# EAGLE design CCM_0008 (EAGLE 9.3.1)
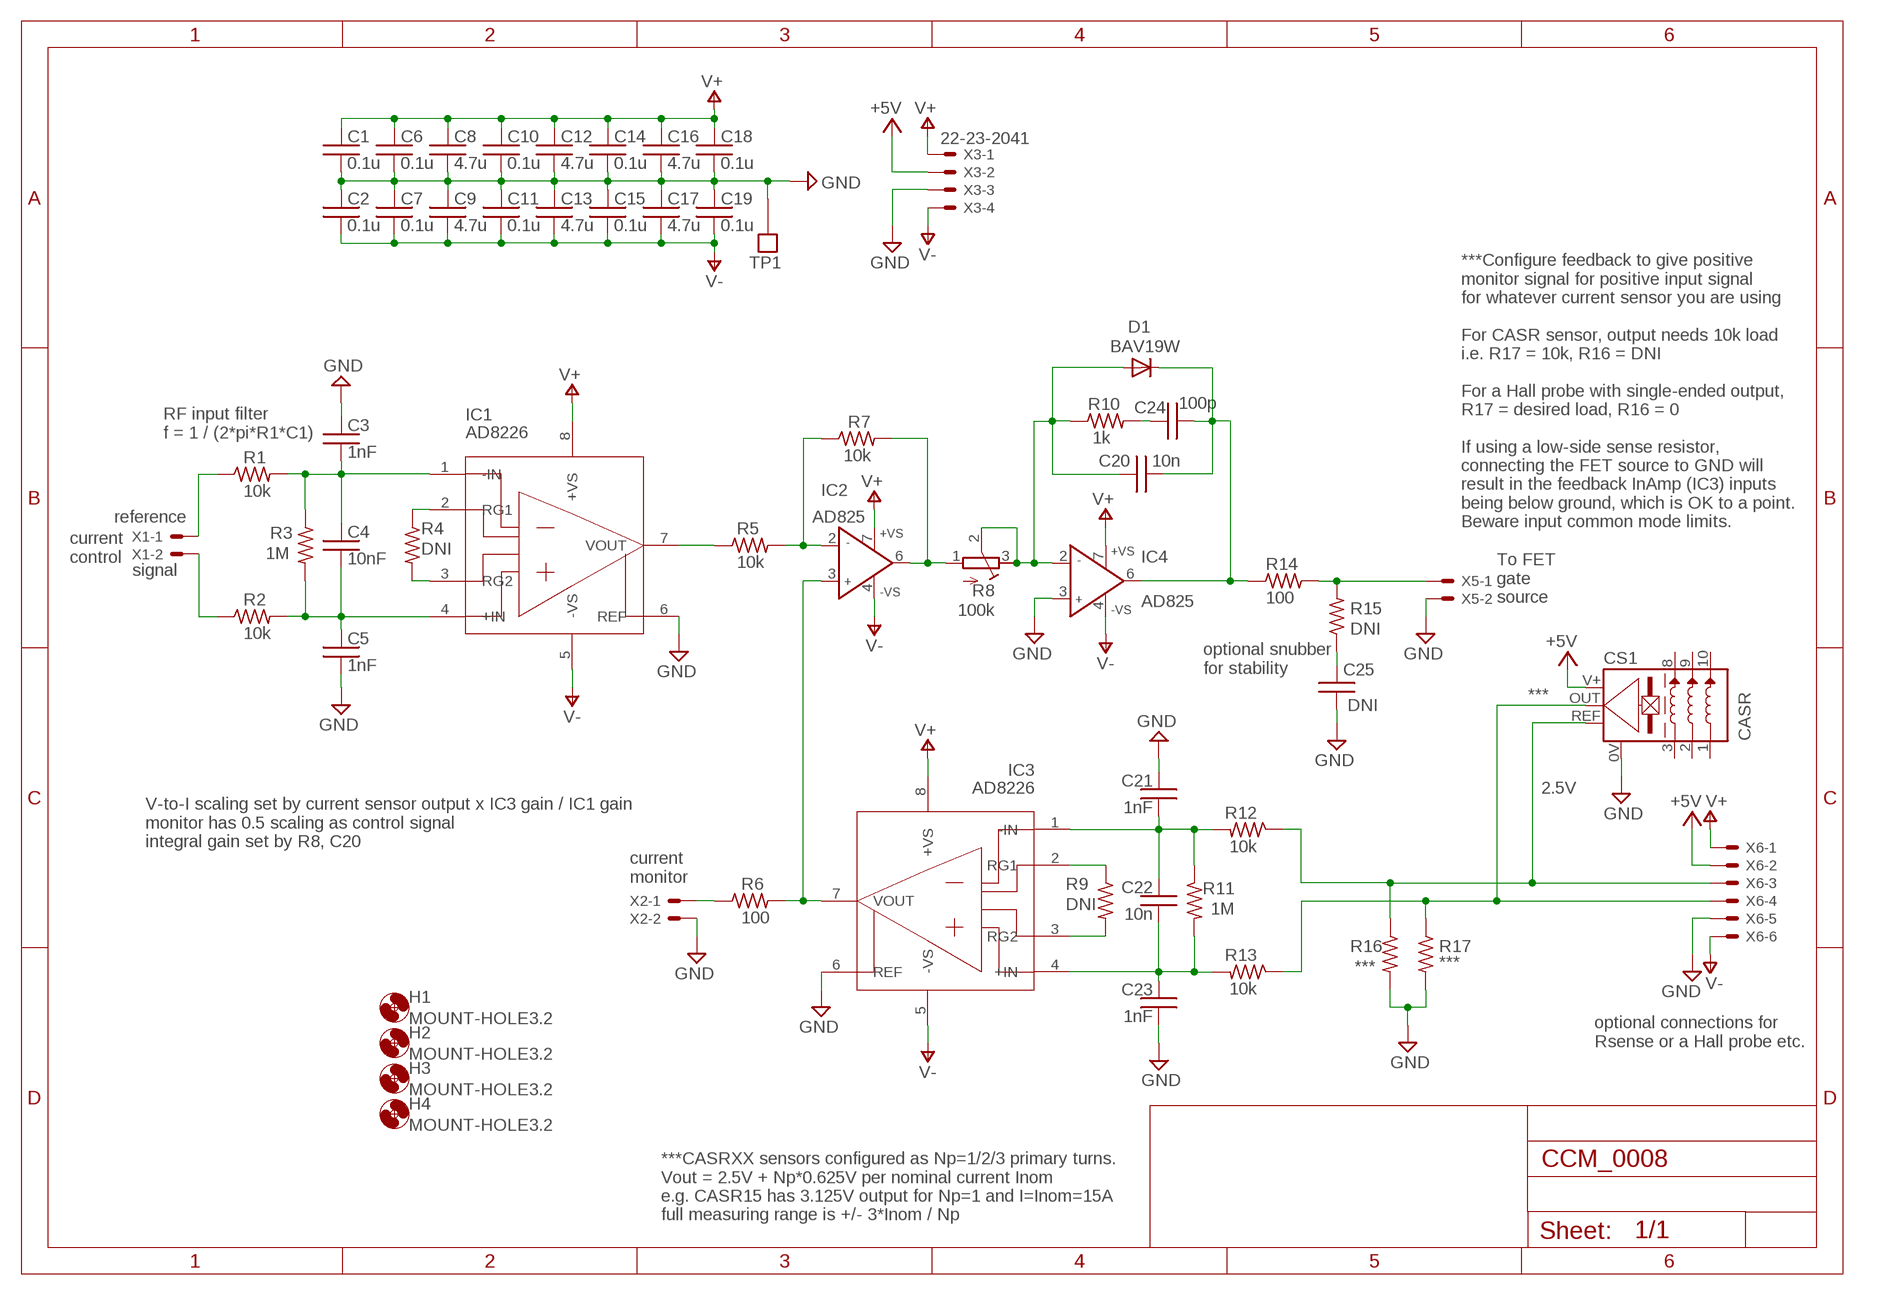
[diagram p0: schematic, sheet 1]

## Parts
C1  0.1u  C0603  [0603]
C2  0.1u  C0603  [0603]
C3  1nF  C0603  [0603]
C4  10nF  C0603  [0603]
C5  1nF  C0603  [0603]
C6  0.1u  C0603  [0603]
C7  0.1u  C0603  [0603]
C8  4.7u  C0603  [0603]
C9  4.7u  C0603  [0603]
C10  0.1u  C0603  [0603]
C11  0.1u  C0603  [0603]
C12  4.7u  C0603  [0603]
C13  4.7u  C0603  [0603]
C14  0.1u  C0603  [0603]
C15  0.1u  C0603  [0603]
C16  4.7u  C0603  [0603]
C17  4.7u  C0603  [0603]
C18  0.1u  C0603  [0603]
C19  0.1u  C0603  [0603]
C20  10n  C0603  [0603]
C21  1nF  C0603  [0603]
C22  10n  C0603  [0603]
C23  1nF  C0603  [0603]
C24  100p  C0603  [0603]
C25  DNI  C0603  [0603]
CS1  CASR  [CASR]
D1  BAV19W  DIODE-SOD123  [SOD123]
H1  MOUNT-HOLE3.2  [3,2]
H2  MOUNT-HOLE3.2  [3,2]
H3  MOUNT-HOLE3.2  [3,2]
H4  MOUNT-HOLE3.2  [3,2]
IC1  AD8226  [SO08]
IC2  AD825  AD825_BR  [SO8]
IC3  AD8226  [SO08]
IC4  AD825  AD825_BR  [SO8]
R1  10k  R0603  [0603]
R2  10k  R0603  [0603]
R3  1M  R0603  [0603]
R4  DNI  R0603  [0603]
R5  10k  R0603  [0603]
R6  100  R0603  [0603]
R7  10k  R0603  [0603]
R8  100k  R-TRIMM3296W  [RTRIM3296W]
R9  DNI  R0603  [0603]
R10  1k  R0603  [0603]
R11  1M  R0603  [0603]
R12  10k  R0603  [0603]
R13  10k  R0603  [0603]
R14  100  R0603  [0603]
R15  DNI  R0603  [0603]
R16  ***  R0603  [0603]
R17  ***  R0603  [0603]
TP1  TESTPOINT  [TESTPOINT]
X1  22-23-2021  [22-23-2021]
X2  22-23-2021  [22-23-2021]
X3  22-23-2041  [22-23-2041]
X5  22-23-2021  [22-23-2021]
X6  22-23-2061  [22-23-2061]

## Nets
+5V: CS1.V+ X3.2 X6.2
GND: C1.2 C2.1 C3.1 C5.2 C6.2 C7.1 C8.2 C9.1 C10.2 C11.1 C12.2 C13.1 C14.2 C15.1 C16.2 C17.1 C18.2 C19.1 C21.1 C23.2 C25.2 CS1.0V IC1.6(REF) IC3.6(REF) IC4.3(IN+) R16.2 R17.2 TP1.P$1 X2.2 X3.3 X5.2 X6.5
N$1: R2.1 X1.2
N$2: R1.1 X1.1
N$3: C20.1 C24.1 D1.C IC4.6(OUT) R14.1
N$4: IC1.2(RG1) R4.1
N$5: C3.2 C4.1 IC1.1(-IN) R1.2 R3.1
N$6: C4.2 C5.1 IC1.4(+IN) R2.2 R3.2
N$7: R6.1 X2.1
N$8: IC1.3(RG2) R4.2
N$12: IC2.3(IN+) IC3.7(VOUT) R6.2
N$13: IC1.7(VOUT) R5.1
N$14: IC2.2(IN-) R5.2 R7.1
N$16: IC2.6(OUT) R7.2 R8.1(A)
N$21: CS1.OUT(VOUT) R13.1 R17.1 X6.4
N$23: IC3.2(RG1) R9.1
N$24: IC3.3(RG2) R9.2
N$25: C21.2 C22.1 IC3.1(-IN) R11.1 R12.2
N$26: C22.2 C23.1 IC3.4(+IN) R11.2 R13.2
N$27: CS1.REF(VREF) R12.1 R16.1 X6.3
N$28: C25.1 R15.1
N$30: C24.2 R10.2
N$33: C20.2 D1.A IC4.2(IN-) R8.2(S) R8.3(E) R10.1
N$34: R14.2 R15.2 X5.1
V+: C1.1 C6.1 C8.1 C10.1 C12.1 C14.1 C16.1 C18.1 IC1.8(+VS) IC2.7(+VS) IC3.8(+VS) IC4.7(+VS) X3.1 X6.1
V-: C2.2 C7.2 C9.2 C11.2 C13.2 C15.2 C17.2 C19.2 IC1.5(-VS) IC2.4(-VS) IC3.5(-VS) IC4.4(-VS) X3.4 X6.6
Unconnected: CS1.1(IN1) CS1.2(IN2) CS1.3(IN3) CS1.8(OUT8) CS1.9(OUT9) CS1.10(OUT10)

## Notes on the sheet
- RF input filter 
  f = 1 / (2*pi*R1*C1)
- reference
- ***Configure feedback to give positive
  monitor signal for positive input signal
  for whatever current sensor you are using
  
  For CASR sensor, output needs 10k load
  i.e. R17 = 10k, R16 = DNI
  
  For a Hall probe with single-ended output,
  R17 = desired load, R16 = 0
  
  If using a low-side sense resistor,
  connecting the FET source to GND will
  result in the feedback InAmp (IC3) inputs 
  being below ground, which is OK to a point.
  Beware input common mode limits.
- current
  control
- signal
- To FET
  gate
  source
- optional snubber
  for stability
- ***
- 2.5V
- V-to-I scaling set by current sensor output x IC3 gain / IC1 gain
  monitor has 0.5 scaling as control signal
  integral gain set by R8, C20
- current
  monitor
- optional connections for 
  Rsense or a Hall probe etc.
- ***CASRXX sensors configured as Np=1/2/3 primary turns.
  Vout = 2.5V + Np*0.625V per nominal current Inom
  e.g. CASR15 has 3.125V output for Np=1 and I=Inom=15A
  full measuring range is +/- 3*Inom / Np

## Library data of the parts
C1-C25 = acrooptics:C: Capacitor
CS1 = custom_parts:CASR: LEM CASR current sensor www.lem.com
D1 = AquariumLibrary:DIODE-: DIODE
H1-H4 = holes:MOUNT-HOLE: MOUNTING HOLE with drill center marker
IC1 IC3 = noah:AD8226
IC2 IC4 = noah:AD825_B: Low Cost, General-Purpose High Speed JFET Amplifier Source: http://www.analog.com/static/imported-files/data_sheets/AD825.pdf; MF: ALTERA CORPORATION; MPN: AD825ARZ; OC_FARNELL: 9603735; OC_NEWARK: 59K6528
R1-R7 R9-R17 = acrooptics:R: 0603 resistor
R8 = rcl:R-TRIMM: Trimm resistor; SPICEMODEL: X; SPICEPREFIXL: POT
TP1 = Fitch:TESTPOINT
X1 X2 X5 = con-molex:22-23-2021: .100" (2.54mm) Center Header - 2 Pin; MF: MOLEX; MPN: 22-23-2021; OC_FARNELL: 1462926; OC_NEWARK: 25C3832
X3 = con-molex:22-23-2041: .100" (2.54mm) Center Header - 4 Pin; MF: MOLEX; MPN: 22-23-2041; OC_FARNELL: 1462920; OC_NEWARK: 38C0355
X6 = con-molex:22-23-2061: .100" (2.54mm) Center Header - 6 Pin; MF: MOLEX; MPN: 22-23-2061; OC_FARNELL: 1462922; OC_NEWARK: 27C1933

## Net classes
1 standard: width 0.61 mm, clearance 0.254 mm

## Board
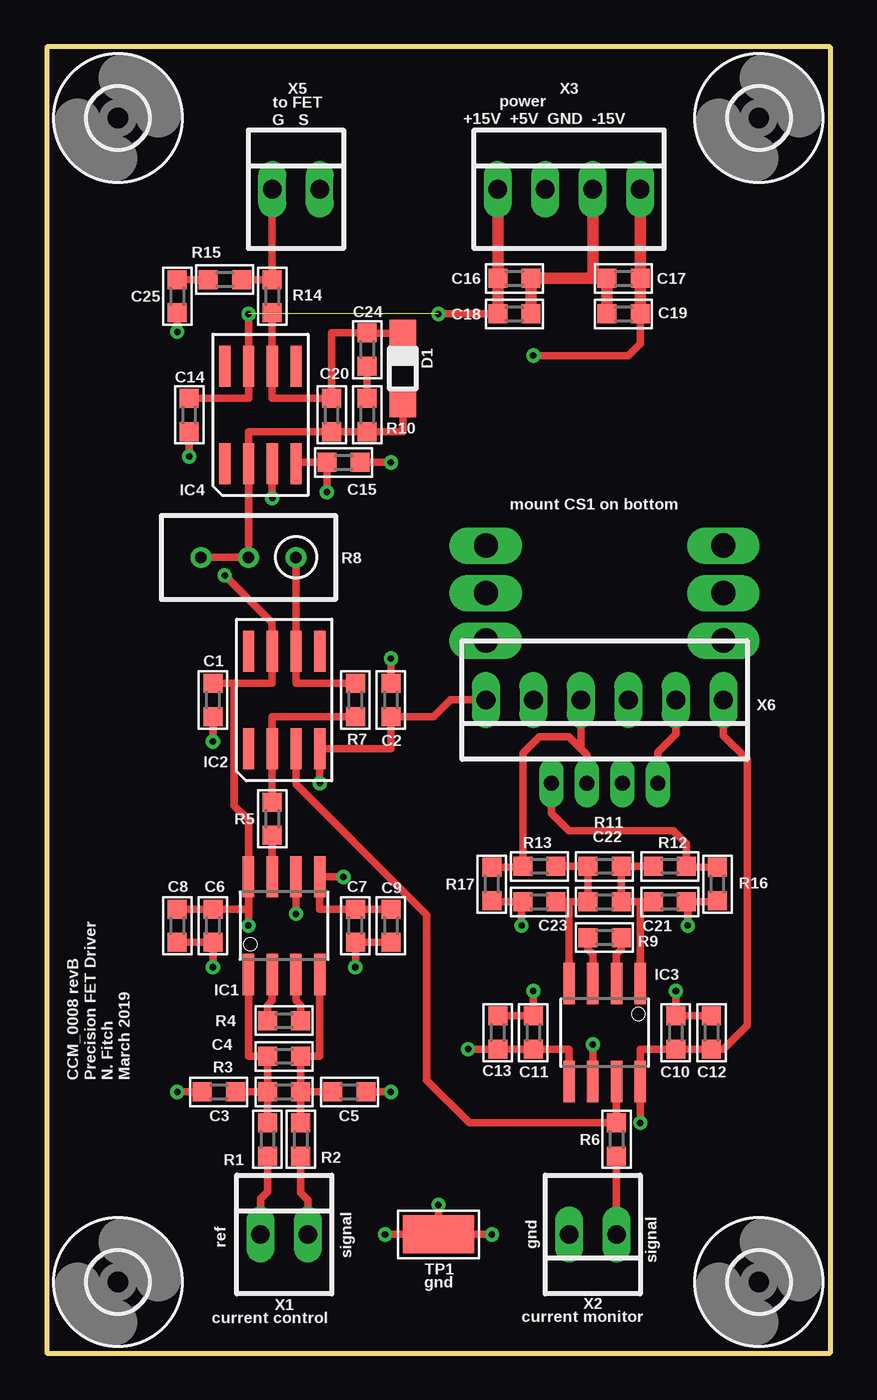
[diagram p1: board, top side]
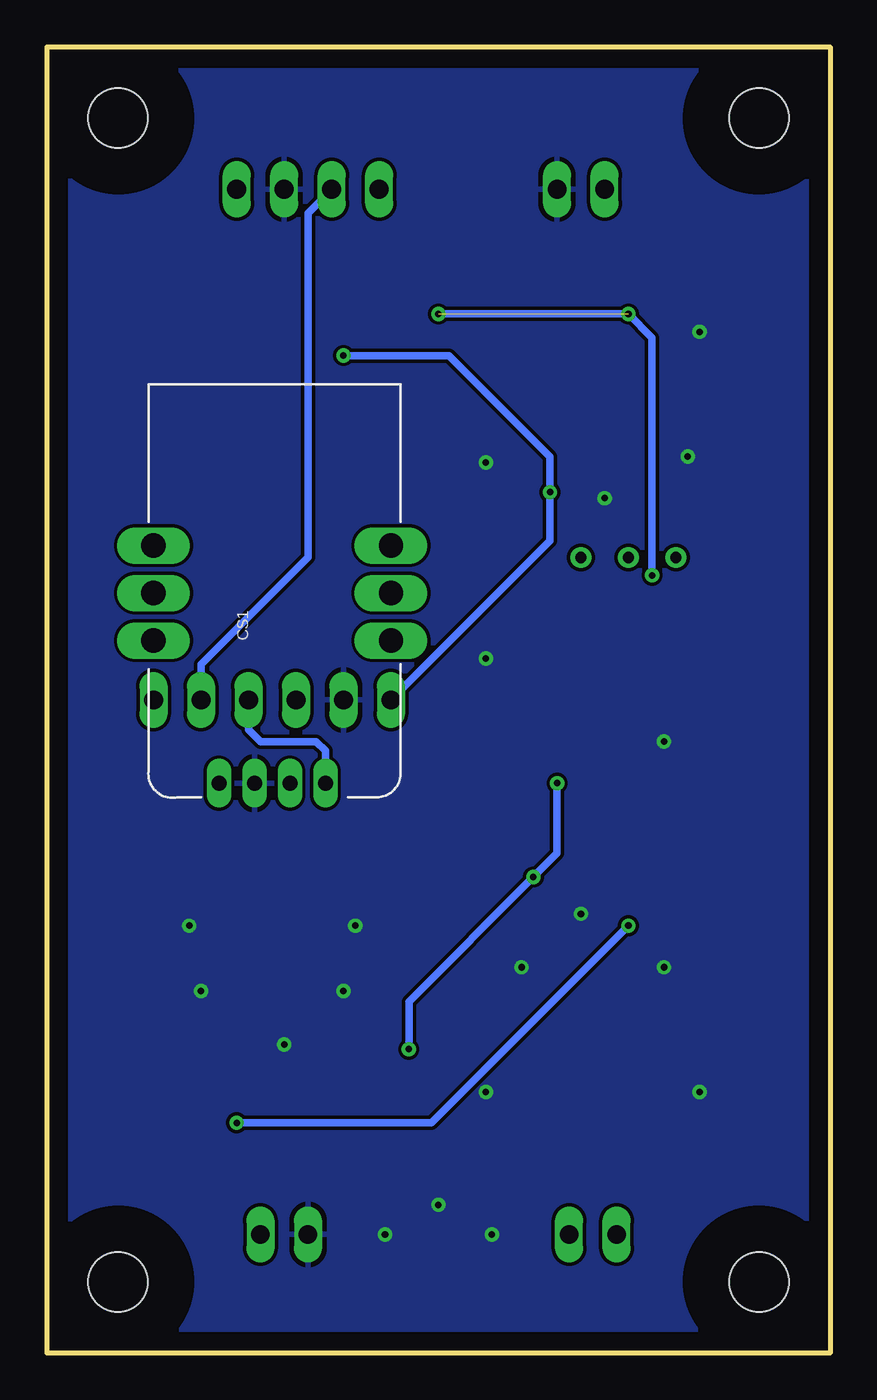
[diagram p2: board, bottom side, seen from below]

Size 41.91 x 69.85 mm. Coordinates in mm from the lower left corner, seen from the top.
Outline: 0,0 41.91,0 41.91,69.85 0,69.85 0,0
Copper layers (1*16): Top 0.035mm / dielectric 1.5mm / Bottom 0.035mm
Design rules "default *": minimum track width 10mil, minimum drill 10mil, track to track 7mil, track to pad 7mil, pad to pad 7mil, via to via 7mil, smd to smd 7mil, copper to edge 10mil, drill to drill 8mil, minimum pad ring 10mil, minimum via ring 8mil, stop-mask expansion 4mil, vias tented up to drill 0mil, thermal gap 10mil

### Footprints (pad centres in the part's own frame; a part is rotated, then mirrored left to right if it is on the bottom)
0603 = smd 1.016 x 1.016: 1 -0.889,0; 2 0.889,0
CASR = drill 0.8 long: 0V -10.16,0.953; OUT -10.16,-0.953; REF -10.16,-2.845; V+ -10.16,2.845 | drill 1.3 long: 1 -2.54,6.35; 2 0,6.35; 3 2.54,6.35; 8 2.54,-6.35; 9 0,-6.35; 10 -2.54,-6.35
SOD123 = smd 1.4 x 1.4: A 1.9,0; C -1.9,0
3,2 = hole 3.2: 0,0
SO08 = smd 0.61 x 2.21: 1 -1.905,-2.616; 2 -0.635,-2.616; 3 0.635,-2.616; 4 1.905,-2.616; 5 1.905,2.616; 6 0.635,2.616; 7 -0.635,2.616; 8 -1.905,2.616
SO8 = smd 0.6 x 2.2: 1 -1.905,-2.6; 2 -0.635,-2.6; 3 0.635,-2.6; 4 1.905,-2.6; 5 1.905,2.6; 6 0.635,2.6; 7 -0.635,2.6; 8 -1.905,2.6
RTRIM3296W = drill 0.61: 1 0,-2.54; 2 0,0; 3 0,2.54
TESTPOINT = smd 3.81 x 2.032: P$1 0,0
22-23-2021 = drill 1 long: 1 -1.27,0; 2 1.27,0
22-23-2041 = drill 1 long: 1 -3.81,0; 2 -1.27,0; 3 1.27,0; 4 3.81,0
22-23-2061 = drill 1 long: 1 -6.35,0; 2 -3.81,0; 3 -1.27,0; 4 1.27,0; 5 3.81,0; 6 6.35,0

### Placement (x,y rotation side)
C1  8.89,34.92 270 top
C2  18.41,34.92 270 top
C3  9.21,13.97 0 top
C4  12.7,15.88 0 top
C5  16.19,13.97 0 top
C6  8.89,22.86 270 top
C7  16.51,22.86 90 top
C8  6.99,22.86 270 top
C9  18.41,22.86 90 top
C10  33.66,17.14 90 top
C11  26.04,17.14 270 top
C12  35.56,17.14 90 top
C13  24.13,17.14 270 top
C14  7.62,50.16 270 top
C15  15.88,47.62 180 top
C16  25.02,57.47 0 top
C17  30.86,57.47 0 top
C18  25.02,55.56 0 top
C19  30.86,55.56 0 top
C20  15.24,50.16 270 top
C21  33.34,24.13 180 top
C22  29.84,24.13 180 top
C23  26.35,24.13 180 top
C24  17.14,53.66 270 top
C25  6.99,56.52 270 top
CS1  29.84,40.64 90 bottom
D1  19.05,52.64 270 top
H1  3.81,3.81 0 top
H2  3.81,66.04 0 top
H3  38.1,3.81 0 top
H4  38.1,66.04 0 top
IC1  12.7,22.86 0 top
IC2  12.7,34.92 0 top
IC3  29.84,17.14 180 top
IC4  11.43,50.16 0 top
R1  11.81,11.43 90 top
R2  13.59,11.43 90 top
R3  12.7,13.97 0 top
R4  12.7,17.78 0 top
R5  12.06,28.57 90 top
R6  30.48,11.43 90 top
R7  16.51,34.92 90 top
R8  10.79,42.55 90 top
R9  29.84,22.23 180 top
R10  17.14,50.16 90 top
R11  29.84,26.04 180 top
R12  33.34,26.04 180 top
R13  26.35,26.04 0 top
R14  12.06,56.52 90 top
R15  9.53,57.4 0 top
R16  35.88,25.08 270 top
R17  23.81,25.08 270 top
TP1  20.95,6.35 0 top
X1  12.7,6.35 0 top
X2  29.21,6.35 180 top
X3  27.94,62.23 0 top
X5  13.34,62.23 0 top
X6  29.84,34.92 180 top

### Tracks (layer width: path | path; a pad name or v marks a point on that pad's centre or on a via)
+5V
  Top 0.406: X6.2 33.66,33.08 32.69,32.12 CS1.V+
  Bottom 0.406: X3.2 27.94,60.96 27.94,42.55 33.66,36.83 X6.2
GND  (via drill 0.35)
  Top 0.406: IC1.6 v13.34,23.5 | C5.2 v18.41,13.97 | C3.1 v6.99,13.97 | v16.51,20.64 C7.1 C9.1 | v8.89,20.64 C6.2 C8.2 | C1.2 v8.89,32.7 | C2.1 v18.41,37.15 | C25.2 v6.99,54.61 | v26.04,19.37 C11.1 C13.1 | v33.66,19.37 C10.2 C12.2 | R17.2 23.88,24.13 C23.2 25.4,24.07 v25.4,22.86 | R16.2 35.81,24.13 C21.1 34.29,24.07 v34.29,22.86 | IC3.6 v29.21,16.51 | TP1.P$1 v18.1,6.35 | TP1.P$1 v20.95,7.94 | TP1.P$1 v23.81,6.35 | IC4.3 v12.06,45.72 | C14.2 v7.62,47.94 | C15.1 v18.41,47.62
  Top 0.61: C18.2 C16.2 29.15,57.47 | C19.1 C17.1 29.15,57.47 | X3.3 29.21,57.53 29.15,57.47
  pour Bottom: 1.27,1.27 1.27,68.58 40.64,68.58 40.64,1.27
N$1
  Top 0.406: R2.1 13.59,8.57 13.97,8.19 X1.2
N$2
  Top 0.406: R1.1 11.81,8.64 11.43,8.26 X1.1
N$3
  Top 0.406: D1.C C24.1 15.24,54.55 C20.1 12.06,51.05 IC4.6 R14.1
N$4
  Top 0.406: IC1.2 12.06,18.86 11.81,18.61 R4.1
N$5
  Top 0.406: IC1.1 10.79,15.88 C4.1 R3.1 | C3.2 R3.1 | R3.1 R1.2
N$6
  Top 0.406: IC1.4 14.61,15.88 C4.2 R3.2 | R3.2 C5.1 | R3.2 R2.2
N$7
  Top 0.406: R6.1 X2.1
N$8
  Top 0.406: IC1.3 13.34,18.86 13.59,18.61 R4.2
N$12
  Top 0.406: IC3.7 R6.2 22.61,12.32 20.32,14.61 20.32,23.43 13.34,30.42 IC2.3
N$13
  Top 0.406: R5.1 IC1.7
N$14
  Top 0.406: R7.1 12.06,34.04 IC2.2 R5.2
N$16
  Top 0.406: R7.2 13.34,35.81 IC2.6 R8.1
N$21
  Top 0.406: R17.1 25.4,25.97 R13.1 25.46,32.07 26.35,32.96 27.94,32.96 28.57,32.32 | CS1.OUT 28.89,32 28.57,32.32 | X6.4 28.57,32.32
N$23
  Top 0.406: IC3.2 30.48,21.34 30.73,21.59 R9.1
N$24
  Top 0.406: IC3.3 29.21,21.34 28.96,21.59 R9.2
N$25
  Top 0.406: 31.75,24.13 C22.1 R11.1 R12.2 | 31.75,24.13 C21.2 | IC3.1 31.75,24.13
N$26
  Top 0.406: 27.94,24.13 C22.2 R11.2 R13.2 | 27.94,24.13 C23.1 | IC3.4 27.94,24.13
N$27
  Top 0.406: R16.1 34.29,25.97 R12.1 34.23,27.24 33.53,27.94 27.94,27.94 27,28.88 CS1.REF
  Bottom 0.406: X6.3 31.11,33.34 30.48,32.7 27.5,32.7 27,32.21 CS1.REF
N$28
  Top 0.406: R15.1 C25.1
N$30
  Top 0.406: C24.2 R10.2
N$33
  Top 0.406: D1.A 19.05,49.28 R10.1 C20.2 10.79,49.28 IC4.2 R8.2 R8.3
N$34
  Top 0.406: R15.2 R14.2 X5.1
V+  (via drill 0.35)  (1 unrouted)
  Top 0.406: 10.79,23.75 IC1.8 10.79,28.51 10.03,29.27 10.03,35.81 | 10.79,23.75 C6.1 C8.1 | 10.03,35.81 12.06,35.81 IC2.7 12.06,39.05 v9.53,41.59 | 10.03,35.81 C1.1 | X6.1 36.2,33.02 37.47,31.75 37.47,17.53 36.2,16.26 C12.1 C10.1 31.75,16.26 IC3.8 v31.75,12.32 | C14.1 10.79,51.05 IC4.7 v10.79,55.56 | C18.1 v20.95,55.56 | 10.79,23.75 v10.79,22.86
  Top 0.61: X3.1 C16.1 C18.1
  Bottom 0.406: v20.95,55.56 v10.79,55.56 9.53,54.29 v9.53,41.59 | v10.79,22.86 21.34,12.32 v31.75,12.32
V-  (via drill 0.35)
  Top 0.406: 13.34,47.69 13.34,47.62 | 13.34,47.62 IC4.4 | IC3.5 27.94,16.26 C11.2 C13.2 v22.54,16.26 | C9.2 C7.2 14.61,23.75 IC1.5 15.86,25.48 v15.88,25.46 | X6.6 21.59,34.92 20.7,34.04 C2.2 18.41,32.33 IC2.4 v14.61,30.48 | 13.34,47.62 C15.2 v14.99,46.04 | C19.2 31.75,53.98 31.11,53.34 v26.04,53.34
  Top 0.61: C19.2 C17.2 X3.4
  Bottom 0.406: X6.6 14.99,43.43 v14.99,46.04 14.99,47.94 20.38,53.34 v26.04,53.34 | v22.54,16.26 22.54,18.8 v15.88,25.46 14.61,26.73 v14.61,30.48

### Text on the board
tPlace: CCM_0008 revB / Precision FET Driver / N. Fitch / March 2019 | gnd
tNames: to FET / G S | power / +15V +5V GND -15V | mount CS1 on bottom | ref | gnd | signal | signal | current control | current monitor